# Altium schematic sheet Sheet4.SchDoc
size A; SheetNumber: 1; SheetTotal: 1
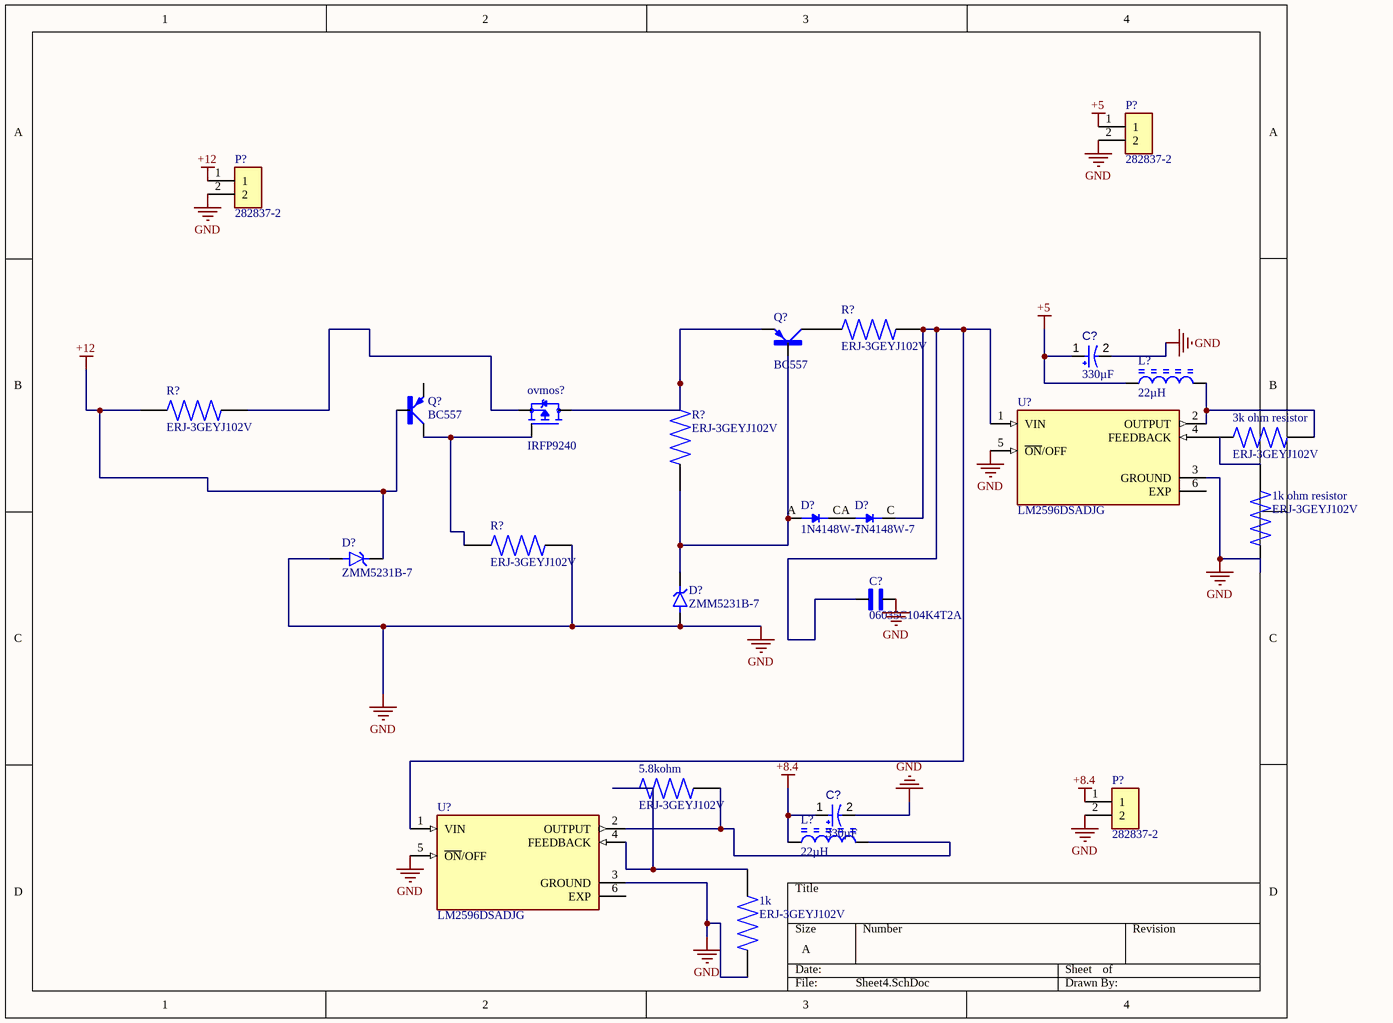
[diagram p0: Sheet4.SchDoc]

## Parts
(Parts that share a designator on the sheet are numbered #1, #2 ... from top to bottom, then left to right.)
1k  ERJ-3GEYJ102V  [RES_ERJ-3GEYJ102V]
1k_ohm_resistor  ERJ-3GEYJ102V  [RES_ERJ-3GEYJ102V]
3k_ohm_resistor  ERJ-3GEYJ102V  [RES_ERJ-3GEYJ102V]
5.8kohm  ERJ-3GEYJ102V  [RES_ERJ-3GEYJ102V]
C?#1  value 330µF  [PNSC-6TPF220M5L]  (hidden comment: Capacitor 330µF +/-20% 6.3V D3)
C?#2  06035C104K4T2A  [CAPC1608X90N]
C?#3  value 330µF  [PNSC-6TPF220M5L]  (hidden comment: Capacitor 330µF +/-20% 6.3V D3)
D?#1  1N4148W-7  [SOD3715X135N]
D?#2  1N4148W-7  [SOD3715X135N]
D?#3  ZMM5231B-7  [DIOMELF3514N]
D?#4  ZMM5231B-7  [DIOMELF3514N]
L?#1  Inductance: 22µH  [BOUR-CM322522_V]  (hidden comment: CM322522-100KL)
L?#2  Inductance: 22µH  [BOUR-CM322522_V]  (hidden comment: CM322522-100KL)
ovmos?  IRFP9240  [TO-247_XA.AMP.P]
P?#1  282837-2  [TE_282837-2]
P?#2  282837-2  [TE_282837-2]
P?#3  282837-2  [TE_282837-2]
Q?#1  BC557  [SOT54A]
Q?#2  BC557  [SOT54A]
R?#1  ERJ-3GEYJ102V  [RES_ERJ-3GEYJ102V]
R?#2  ERJ-3GEYJ102V  [RES_ERJ-3GEYJ102V]
R?#3  ERJ-3GEYJ102V  [RES_ERJ-3GEYJ102V]
R?#4  ERJ-3GEYJ102V  [RES_ERJ-3GEYJ102V]
U?#1  LM2596DSADJG  [CONV_LM2596DSADJG]
U?#2  LM2596DSADJG  [CONV_LM2596DSADJG]

## Nets
+5: C?#1.1 L?#1.1 P?#1.1
+8.4: C?#3.1 L?#2.1 P?#3.1
+12: D?#3.1(K) P?#2.1 Q?#2.B R?#2.1
GND: 1k.1 1k_ohm_resistor.1 C?#1.2 C?#2.2 C?#3.2 D?#3.2(A) D?#4.2(A) P?#1.2 P?#2.2 P?#3.2 R?#4.2 U?#1.3(GROUND) U?#1.5(~{ON}/OFF) U?#2.3(GROUND) U?#2.5(~{ON}/OFF)
Net1k_2: 1k.2 5.8kohm.2 U?#2.4(FEEDBACK)
Net3k_ohm_resistor_1: 3k_ohm_resistor.1 L?#1.2 U?#1.2(OUTPUT)
Net3k_ohm_resistor_2: 3k_ohm_resistor.2 U?#1.4(FEEDBACK)
Net5.8kohm_1: 5.8kohm.1 L?#2.2 U?#2.2(OUTPUT)
NetC?#2_1: C?#2.1 D?#2.C(K) R?#1.1 U?#1.1(VIN) U?#2.1(VIN)
NetD?#1_A: D?#1.A D?#4.1(K) Q?#1.B R?#3.1
NetD?#1_C: D?#1.C(K) D?#2.A
Netovmos?_D: ovmos?.D Q?#1.E R?#3.2
Netovmos?_G: ovmos?.G Q?#2.C R?#4.1
Netovmos?_S: ovmos?.S R?#2.2
NetQ?#1_C: Q?#1.C R?#1.2

Not connected (* = marked no-connect by the designer): 1k_ohm_resistor 2; Q?#2 E; U?#1 6(EXP); U?#2 6(EXP)

## Library data of the parts
1k 1k_ohm_resistor 3k_ohm_resistor 5.8kohm R?#1-R?#4 = ERJ-3GEYJ102V: Series/Type: Thick Film Chip Resistors, Power Rating (W): 0.1, Chip Size (LxW(EIA)) (mm): 1.6 x 0.8 (EIA:0603), Resistance Values (â„¦): 1000, Resistance Tolerance (%): 5, T.C.R (Ã—10â»â¶/K): Â±200; MF: Panasonic; SnapEDA_Link: https://www.snapeda.com/parts/ERJ-3GEYJ102V/Panasonic+Electronic+Components/view-part/?ref=snap; Price: None; Check_prices: https://www.snapeda.com/parts/ERJ-3GEYJ102V/Panasonic+Electronic+Components/view-part/?ref=eda; Purchase-URL: https://pricing.snapeda.com/search/part/ERJ-3GEYJ102V/?ref=eda; MP: ERJ-3GEYJ102V; Value: *; Availability: In Stock; Package: 1608-2 Panasonic
C?#1 C?#3 = CMP-001-00058-3: Molded Tantalum Polymer Capacitor, 330 uF, +/- 20%, 6.3 V, -55 to 105 degC, 2-Pin SMD, RoHS, Tape and Reel; Voltage Rating: 6.3V; Min Operating Temperature: -55°C; Tolerance: 20%; Pins: 2; Case/Package: 1210; Max Operating Temperature: 105°C; Mounting Technology: SMT
C?#2 = 06035C104K4T2A: Capacitor MLCC 0603 100nF 50V | AVX 06035C104K4T2A; SnapEDA_Link: https://www.snapeda.com/parts/06035C104K4T2A/AVX/view-part/?ref=snap; Package: 1608 AVX; Value: *; MF: AVX; MP: 06035C104K4T2A; Check_prices: https://www.snapeda.com/parts/06035C104K4T2A/AVX/view-part/?ref=eda
D?#1 D?#2 = 1N4148W-7: Diode Standard 100 V 300mA (DC) Surface Mount SOD-123; MF: Diodes Inc.; SnapEDA_Link: https://www.snapeda.com/parts/1N4148W-7/Diodes+Inc./view-part/?ref=snap; Package: SOD-123 Fairchild Semiconductor; MP: 1N4148W-7; Check_prices: https://www.snapeda.com/parts/1N4148W-7/Diodes+Inc./view-part/?ref=eda; Purchase-URL: https://pricing.snapeda.com/search/part/1N4148W-7/?ref=eda; Price: None; Value: *; Availability: In Stock
D?#3 D?#4 = ZMM5231B-7: Zener Diode 5.1 V 500 mW ±5% Surface Mount DO-213AA (GL34); MF: Diodes Incorporated; SnapEDA_Link: https://www.snapeda.com/parts/ZMM5231B-7/Diodes+Inc./view-part/?ref=snap; Package: SOD-80 Diodes Incorporated; Value: *; MP: ZMM5231B-7; Check_prices: https://www.snapeda.com/parts/ZMM5231B-7/Diodes+Inc./view-part/?ref=eda
L?#1 L?#2 = CMP-006-00005-3: Chip Inductor, 10 uH, +/- 10%, -40 to 125 degC, 1210 (3225 Metric), RoHS, Tape and Reel; Manufacturer: Bourns; Current Rating: 140mA; Q Factor: 30; Self Resonant Frequency: 30MHz; Core Material: Ferrite; Shielding: Unshielded; Resistance: 2.1Ohm; Mounting Technology: SM; Min Operating Temperature: -20°C; Datasheet URL: http://www.murata.com/~/media/webrenewal/support/library/catalog/products/emc/emifil/c30e.ashx?la=en-gb; Case/Package: 1210; Pins: 2; Package Description: 2-Pin Surface Mount Device, Body 3.2 x 2.5 mm; RoHS Compliant: True; Max Operating Temperature: 100°C; Inductance Tolerance: 10%; Package Reference: 1210; Packaging: TapeandReel; Package Quantity: 1; Datasheet Version: Aug-14; Tolerance: 10%
ovmos? = IRFP9240: P-Channel 200 V 12A (Tc) 150W (Tc) Ø¹Ø¨Ø± Ø§Ù„ÙØªØ­Ø© TO-247AC; MF: Vishay Siliconix; Price: None; Availability: In Stock; Package: TO-247 Vishay Siliconix; Check_prices: https://www.snapeda.com/parts/IRFP9240/Vishay+Siliconix/view-part/?ref=eda; MP: IRFP9240; Value: *; SnapEDA_Link: https://www.snapeda.com/parts/IRFP9240/Vishay+Siliconix/view-part/?ref=snap; Purchase-URL: https://pricing.snapeda.com/search/part/IRFP9240/?ref=eda
P?#1-P?#3 = 282837-2: Ð Ð°Ð·ÑŠÐµÐ¼Ð½Ñ‹Ðµ ÐºÐ»ÐµÐ¼Ð¼Ð½Ñ‹Ðµ ÐºÐ¾Ð»Ð¾Ð´ÐºÐ¸ Ð Ð¾Ð·ÐµÑ‚ÐºÐ° 2 Ð¿Ð¾Ð»Ð¾Ð¶ÐµÐ½Ð¸Ñ 5,08 Ð¼Ð¼ ÐŸÑ€Ð¸Ð¿Ð¾Ð¹ Ð¿Ñ€ÑÐ¼Ð¾Ð¹ Ñ‡ÐµÑ€ÐµÐ· Ð¾Ñ‚Ð²ÐµÑ€ÑÑ‚Ð¸Ðµ 13,5 Ð / ÐºÐ¾Ð½Ñ‚Ð°ÐºÑ‚; MF: TE Connectivity; SnapEDA_Link: https://www.snapeda.com/parts/282837-2/TE+Connectivity+AMP+Connectors/view-part/?ref=snap; Price: None; Check_prices: https://www.snapeda.com/parts/282837-2/TE+Connectivity+AMP+Connectors/view-part/?ref=eda; Purchase-URL: https://pricing.snapeda.com/search/part/282837-2/?ref=eda; MP: 282837-2; Value: *; Availability: In Stock; Package: None
Q?#1 Q?#2 = BC557: Bipolar (BJT) Transistor PNP 45 V 100 mA 320MHz 625 mW Through Hole TO-92 (TO-226); MF: ON; SnapEDA_Link: https://www.snapeda.com/parts/BC557/Onsemi/view-part/?ref=snap; Package: E-PKG AXIAL-LEADED-2 ON Semiconductor; Value: *; MP: BC557; Check_prices: https://www.snapeda.com/parts/BC557/Onsemi/view-part/?ref=eda
U?#1 U?#2 = LM2596DSADJG: LM2596DSADJG Switching Regulator 3A Adjustable, 1.23 to 37 V, 5-Pin D2PAK | ON Semiconductor LM2596DSADJG; SnapEDA_Link: https://www.snapeda.com/parts/LM2596DSADJG/Onsemi/view-part/?ref=snap; Package: D2PAK-5 ON Semiconductor; Value: *; MF: ON Semiconductor; MP: LM2596DSADJG; Check_prices: https://www.snapeda.com/parts/LM2596DSADJG/Onsemi/view-part/?ref=eda